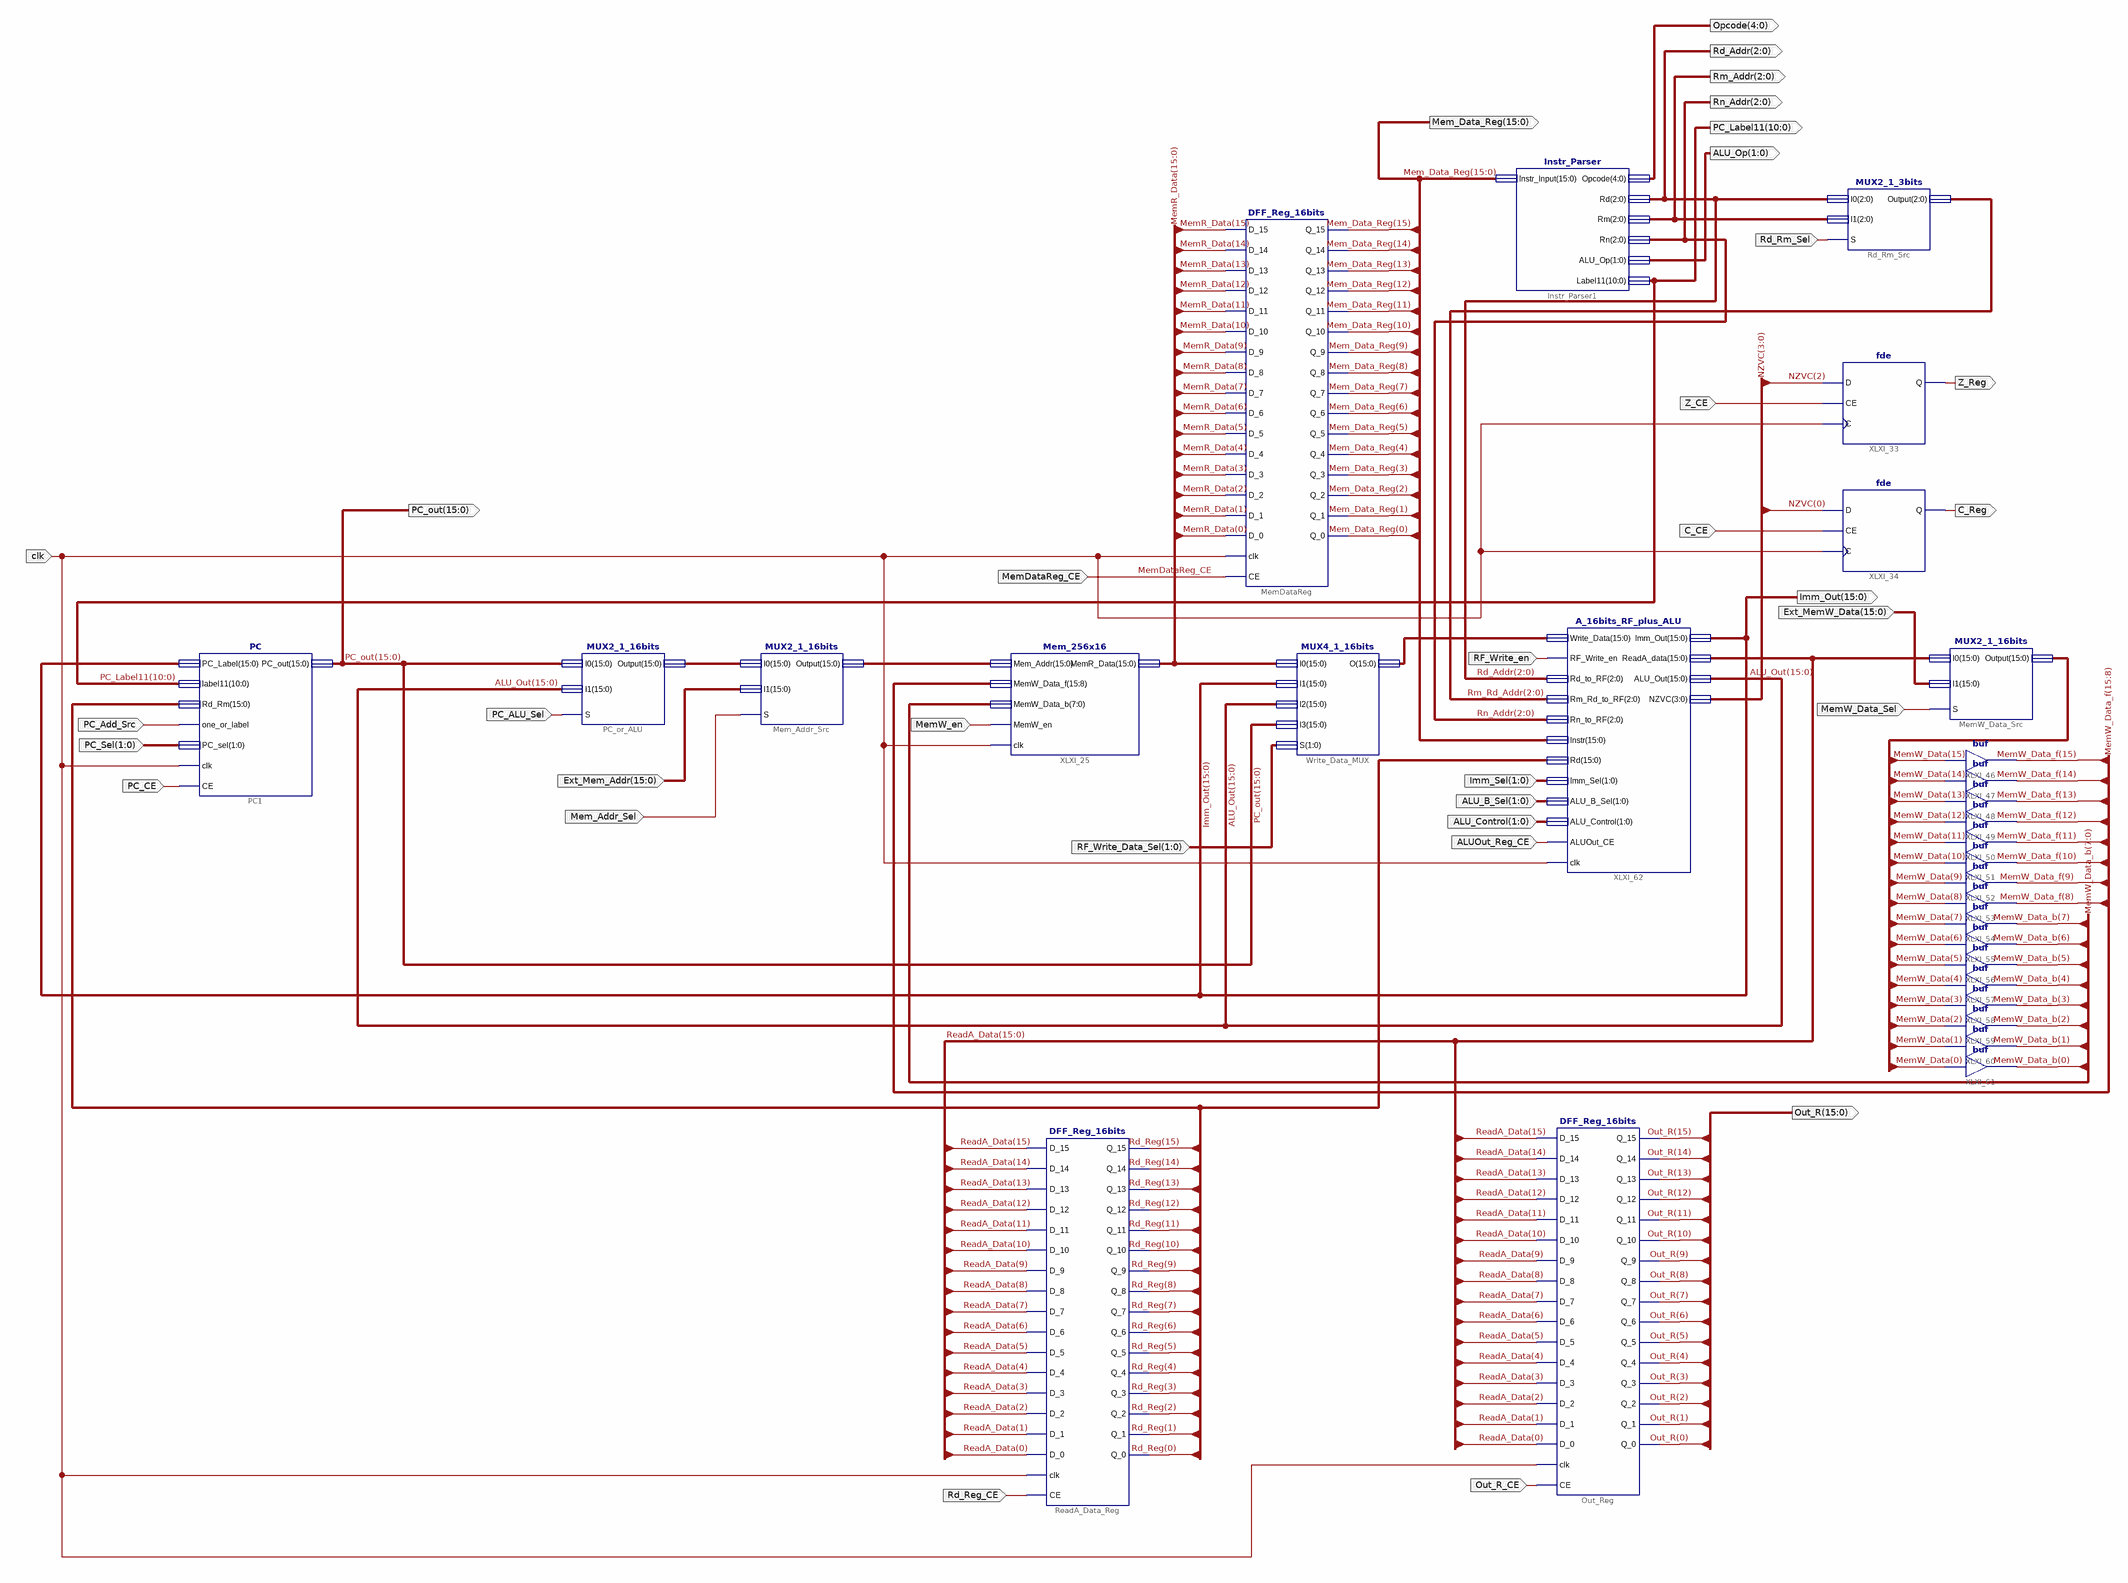
[diagram p0: schematic sheet 1]
// Xilinx ISE schematic Complete_Datapath.sch (virtex6) as structural Verilog: 30 symbols, 34 ports
module Complete_Datapath (
  input  MemW_en,
  input  PC_Add_Src,
  input  [1:0] PC_Sel,
  input  MemDataReg_CE,
  input  clk,
  input  PC_CE,
  input  PC_ALU_Sel,
  input  Z_CE,
  input  C_CE,
  input  [1:0] RF_Write_Data_Sel,
  input  Rd_Reg_CE,
  input  RF_Write_en,
  input  Out_R_CE,
  input  Rd_Rm_Sel,
  input  [15:0] Ext_Mem_Addr,
  input  Mem_Addr_Sel,
  input  [15:0] Ext_MemW_Data,
  input  MemW_Data_Sel,
  input  [1:0] Imm_Sel,
  input  ALUOut_Reg_CE,
  input  [1:0] ALU_B_Sel,
  input  [1:0] ALU_Control,
  output [15:0] PC_out,
  output [10:0] PC_Label11,
  output Z_Reg,
  output C_Reg,
  output [15:0] Mem_Data_Reg,
  output [15:0] Imm_Out,
  output [2:0] Rd_Addr,
  output [15:0] Out_R,
  output [2:0] Rm_Addr,
  output [4:0] Opcode,
  output [1:0] ALU_Op,
  output [2:0] Rn_Addr
);

  wire [2:0] Rm_Rd_Addr;
  wire [3:0] NZVC;
  wire [7:0] MemW_Data_b;
  wire [15:0] ALU_Out, MemR_Data, MemW_Data, Rd_Reg, ReadA_Data, XLXN_142, XLXN_227, XLXN_228;
  wire [15:8] MemW_Data_f;

  MUX2_1_16bits PC_or_ALU (.I0(PC_out), .I1(ALU_Out), .S(PC_ALU_Sel), .Output(XLXN_227));
  DFF_Reg_16bits MemDataReg (
    .CE(MemDataReg_CE), .clk(clk), .D_0(MemR_Data[0]), .D_1(MemR_Data[1]), .D_10(MemR_Data[10]),
    .D_11(MemR_Data[11]), .D_12(MemR_Data[12]), .D_13(MemR_Data[13]), .D_14(MemR_Data[14]),
    .D_15(MemR_Data[15]), .D_2(MemR_Data[2]), .D_3(MemR_Data[3]), .D_4(MemR_Data[4]), .D_5(MemR_Data[5]),
    .D_6(MemR_Data[6]), .D_7(MemR_Data[7]), .D_8(MemR_Data[8]), .D_9(MemR_Data[9]), .Q_0(Mem_Data_Reg[0]),
    .Q_1(Mem_Data_Reg[1]), .Q_10(Mem_Data_Reg[10]), .Q_11(Mem_Data_Reg[11]), .Q_12(Mem_Data_Reg[12]),
    .Q_13(Mem_Data_Reg[13]), .Q_14(Mem_Data_Reg[14]), .Q_15(Mem_Data_Reg[15]), .Q_2(Mem_Data_Reg[2]),
    .Q_3(Mem_Data_Reg[3]), .Q_4(Mem_Data_Reg[4]), .Q_5(Mem_Data_Reg[5]), .Q_6(Mem_Data_Reg[6]),
    .Q_7(Mem_Data_Reg[7]), .Q_8(Mem_Data_Reg[8]), .Q_9(Mem_Data_Reg[9]));
  Mem_256x16 XLXI_25 (
    .Mem_Addr(XLXN_228), .MemW_Data_f(MemW_Data_f), .MemW_Data_b(MemW_Data_b), .MemW_en(MemW_en), .clk(clk),
    .MemR_Data(MemR_Data));
  MUX4_1_16bits Write_Data_MUX (
    .I0(MemR_Data), .I1(Imm_Out), .I2(ALU_Out), .I3(PC_out), .O(XLXN_142), .S(RF_Write_Data_Sel));
  fde XLXI_33 (.C(clk), .CE(Z_CE), .D(NZVC[2]), .Q(Z_Reg));
  fde XLXI_34 (.C(clk), .CE(C_CE), .D(NZVC[0]), .Q(C_Reg));
  DFF_Reg_16bits ReadA_Data_Reg (
    .CE(Rd_Reg_CE), .clk(clk), .D_0(ReadA_Data[0]), .D_1(ReadA_Data[1]), .D_10(ReadA_Data[10]),
    .D_11(ReadA_Data[11]), .D_12(ReadA_Data[12]), .D_13(ReadA_Data[13]), .D_14(ReadA_Data[14]),
    .D_15(ReadA_Data[15]), .D_2(ReadA_Data[2]), .D_3(ReadA_Data[3]), .D_4(ReadA_Data[4]),
    .D_5(ReadA_Data[5]), .D_6(ReadA_Data[6]), .D_7(ReadA_Data[7]), .D_8(ReadA_Data[8]), .D_9(ReadA_Data[9]),
    .Q_0(Rd_Reg[0]), .Q_1(Rd_Reg[1]), .Q_10(Rd_Reg[10]), .Q_11(Rd_Reg[11]), .Q_12(Rd_Reg[12]),
    .Q_13(Rd_Reg[13]), .Q_14(Rd_Reg[14]), .Q_15(Rd_Reg[15]), .Q_2(Rd_Reg[2]), .Q_3(Rd_Reg[3]),
    .Q_4(Rd_Reg[4]), .Q_5(Rd_Reg[5]), .Q_6(Rd_Reg[6]), .Q_7(Rd_Reg[7]), .Q_8(Rd_Reg[8]), .Q_9(Rd_Reg[9]));
  PC PC1 (
    .PC_Label(Imm_Out), .label11(PC_Label11), .Rd_Rm(Rd_Reg), .one_or_label(PC_Add_Src), .PC_sel(PC_Sel),
    .clk(clk), .CE(PC_CE), .PC_out(PC_out));
  DFF_Reg_16bits Out_Reg (
    .CE(Out_R_CE), .clk(clk), .D_0(ReadA_Data[0]), .D_1(ReadA_Data[1]), .D_10(ReadA_Data[10]),
    .D_11(ReadA_Data[11]), .D_12(ReadA_Data[12]), .D_13(ReadA_Data[13]), .D_14(ReadA_Data[14]),
    .D_15(ReadA_Data[15]), .D_2(ReadA_Data[2]), .D_3(ReadA_Data[3]), .D_4(ReadA_Data[4]),
    .D_5(ReadA_Data[5]), .D_6(ReadA_Data[6]), .D_7(ReadA_Data[7]), .D_8(ReadA_Data[8]), .D_9(ReadA_Data[9]),
    .Q_0(Out_R[0]), .Q_1(Out_R[1]), .Q_10(Out_R[10]), .Q_11(Out_R[11]), .Q_12(Out_R[12]), .Q_13(Out_R[13]),
    .Q_14(Out_R[14]), .Q_15(Out_R[15]), .Q_2(Out_R[2]), .Q_3(Out_R[3]), .Q_4(Out_R[4]), .Q_5(Out_R[5]),
    .Q_6(Out_R[6]), .Q_7(Out_R[7]), .Q_8(Out_R[8]), .Q_9(Out_R[9]));
  Instr_Parser Instr_Parser1 (
    .Instr_Input(Mem_Data_Reg), .Opcode(Opcode), .Rd(Rd_Addr), .Rm(Rm_Addr), .Rn(Rn_Addr), .ALU_Op(ALU_Op),
    .Label11(PC_Label11));
  MUX2_1_3bits Rd_Rm_Src (.S(Rd_Rm_Sel), .I0(Rd_Addr), .I1(Rm_Addr), .Output(Rm_Rd_Addr));
  MUX2_1_16bits Mem_Addr_Src (.I0(XLXN_227), .I1(Ext_Mem_Addr), .S(Mem_Addr_Sel), .Output(XLXN_228));
  MUX2_1_16bits MemW_Data_Src (.I0(ReadA_Data), .I1(Ext_MemW_Data), .S(MemW_Data_Sel), .Output(MemW_Data));
  buf XLXI_46 (MemW_Data_f[15], MemW_Data[15]);
  buf XLXI_47 (MemW_Data_f[14], MemW_Data[14]);
  buf XLXI_48 (MemW_Data_f[13], MemW_Data[13]);
  buf XLXI_49 (MemW_Data_f[12], MemW_Data[12]);
  buf XLXI_50 (MemW_Data_f[11], MemW_Data[11]);
  buf XLXI_51 (MemW_Data_f[10], MemW_Data[10]);
  buf XLXI_52 (MemW_Data_f[9], MemW_Data[9]);
  buf XLXI_53 (MemW_Data_f[8], MemW_Data[8]);
  buf XLXI_54 (MemW_Data_b[7], MemW_Data[7]);
  buf XLXI_55 (MemW_Data_b[6], MemW_Data[6]);
  buf XLXI_56 (MemW_Data_b[5], MemW_Data[5]);
  buf XLXI_57 (MemW_Data_b[4], MemW_Data[4]);
  buf XLXI_58 (MemW_Data_b[3], MemW_Data[3]);
  buf XLXI_59 (MemW_Data_b[2], MemW_Data[2]);
  buf XLXI_60 (MemW_Data_b[1], MemW_Data[1]);
  buf XLXI_61 (MemW_Data_b[0], MemW_Data[0]);
  A_16bits_RF_plus_ALU XLXI_62 (
    .Write_Data(XLXN_142), .RF_Write_en(RF_Write_en), .Rd_to_RF(Rd_Addr), .Rm_Rd_to_RF(Rm_Rd_Addr),
    .Rn_to_RF(Rn_Addr), .Instr(Mem_Data_Reg), .Rd(Rd_Reg), .Imm_Sel(Imm_Sel), .ALU_B_Sel(ALU_B_Sel),
    .ALU_Control(ALU_Control), .ALUOut_CE(ALUOut_Reg_CE), .clk(clk), .ReadA_data(ReadA_Data),
    .ALU_Out(ALU_Out), .NZVC(NZVC), .Imm_Out(Imm_Out));
endmodule
